# Altium schematic sheet 0001_Page 1.SchDoc
size 426 x 274 mm
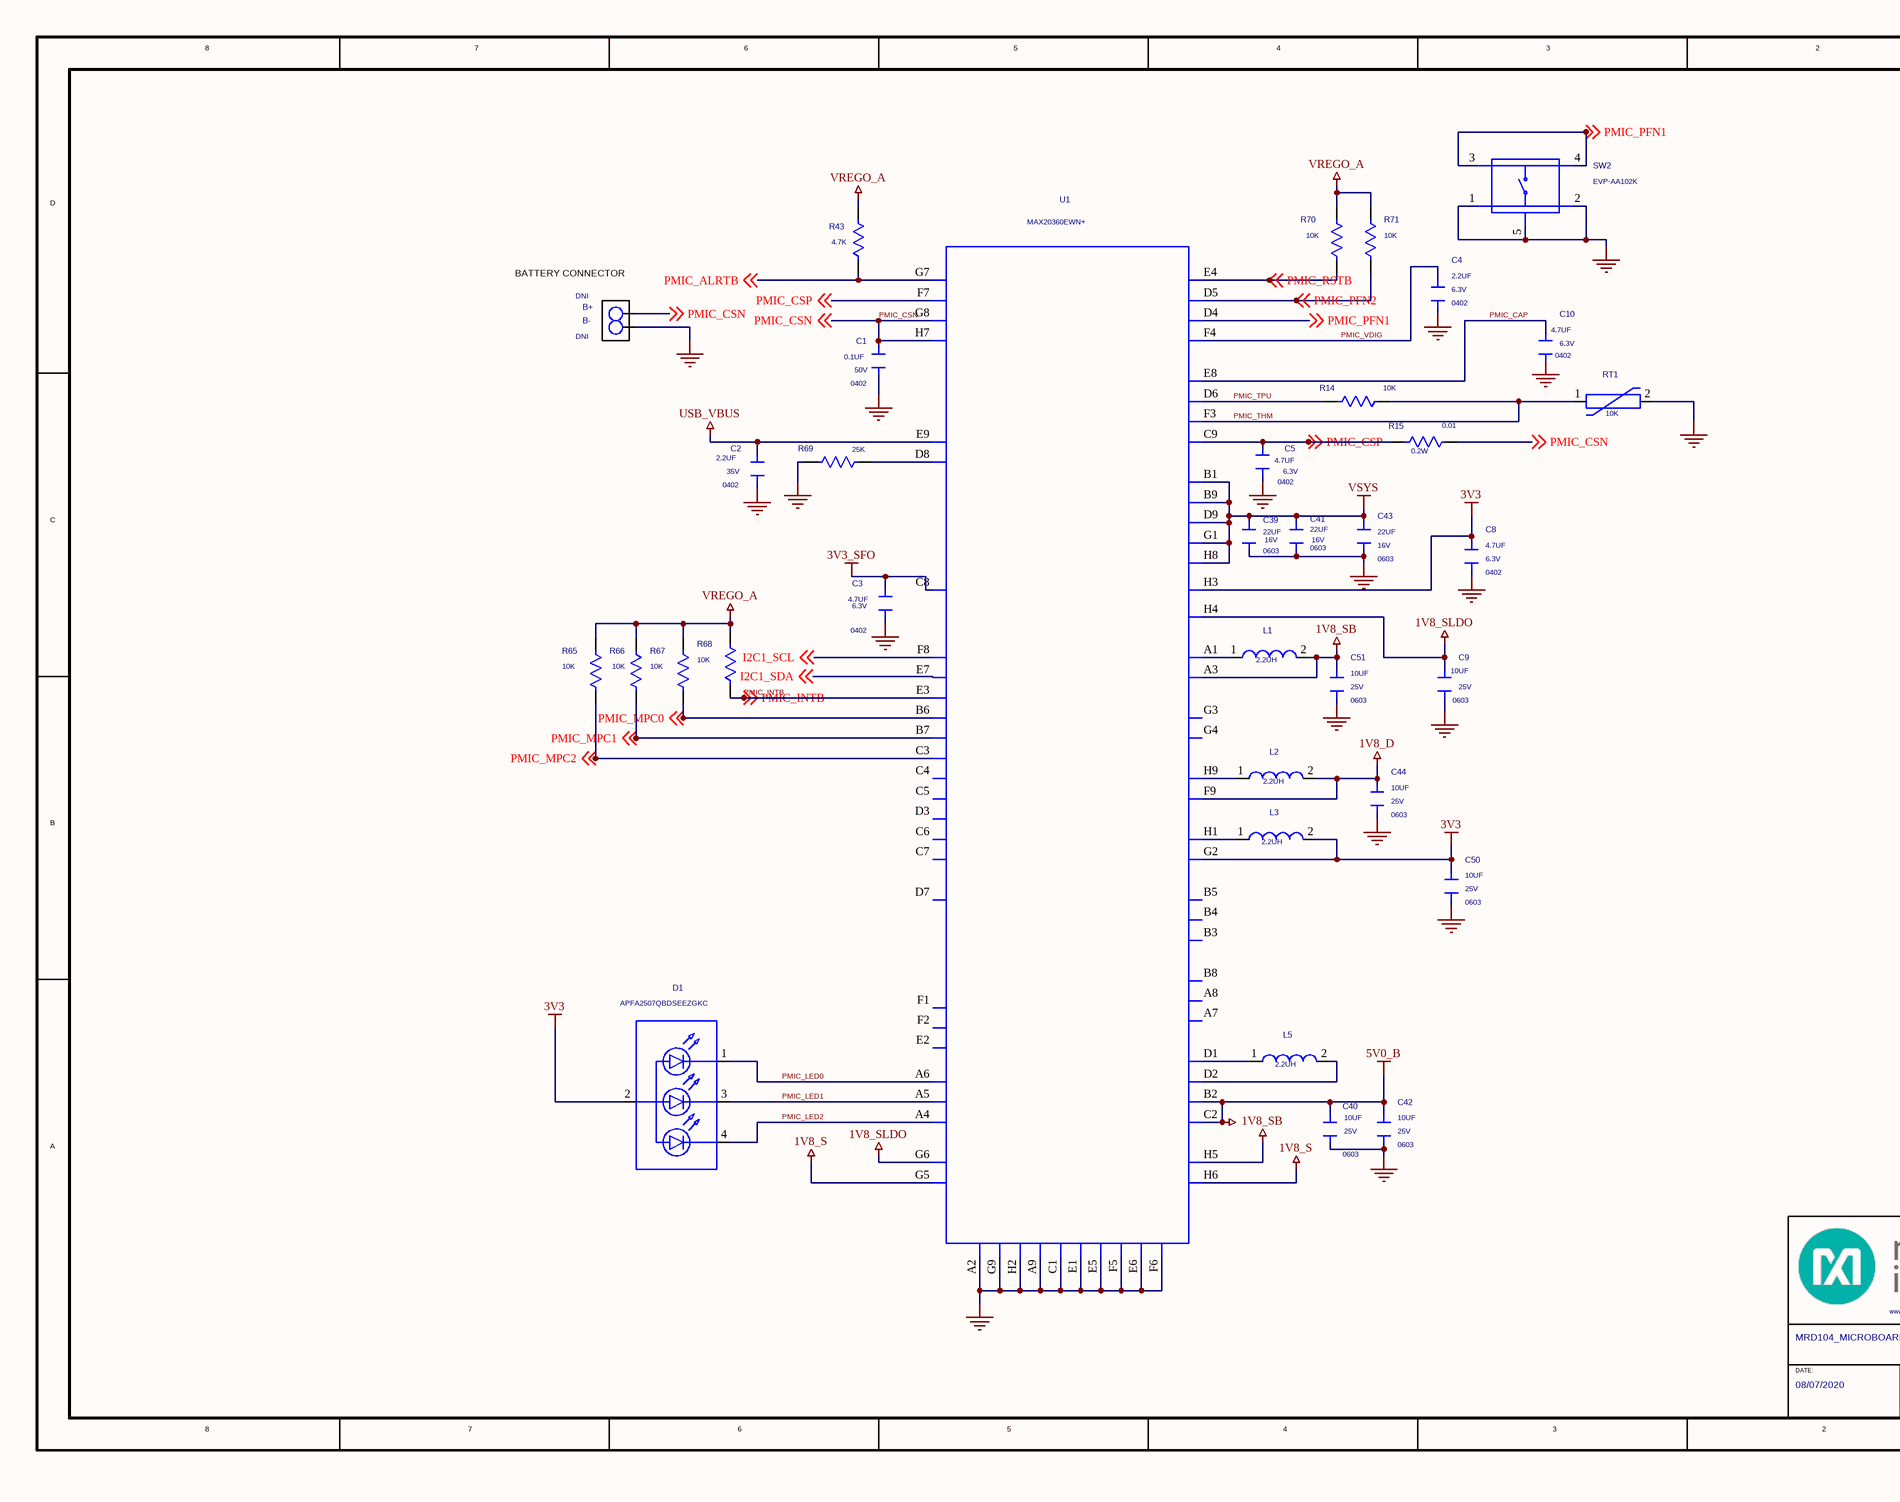
[diagram p0: 0001_Page 1.SchDoc, left]
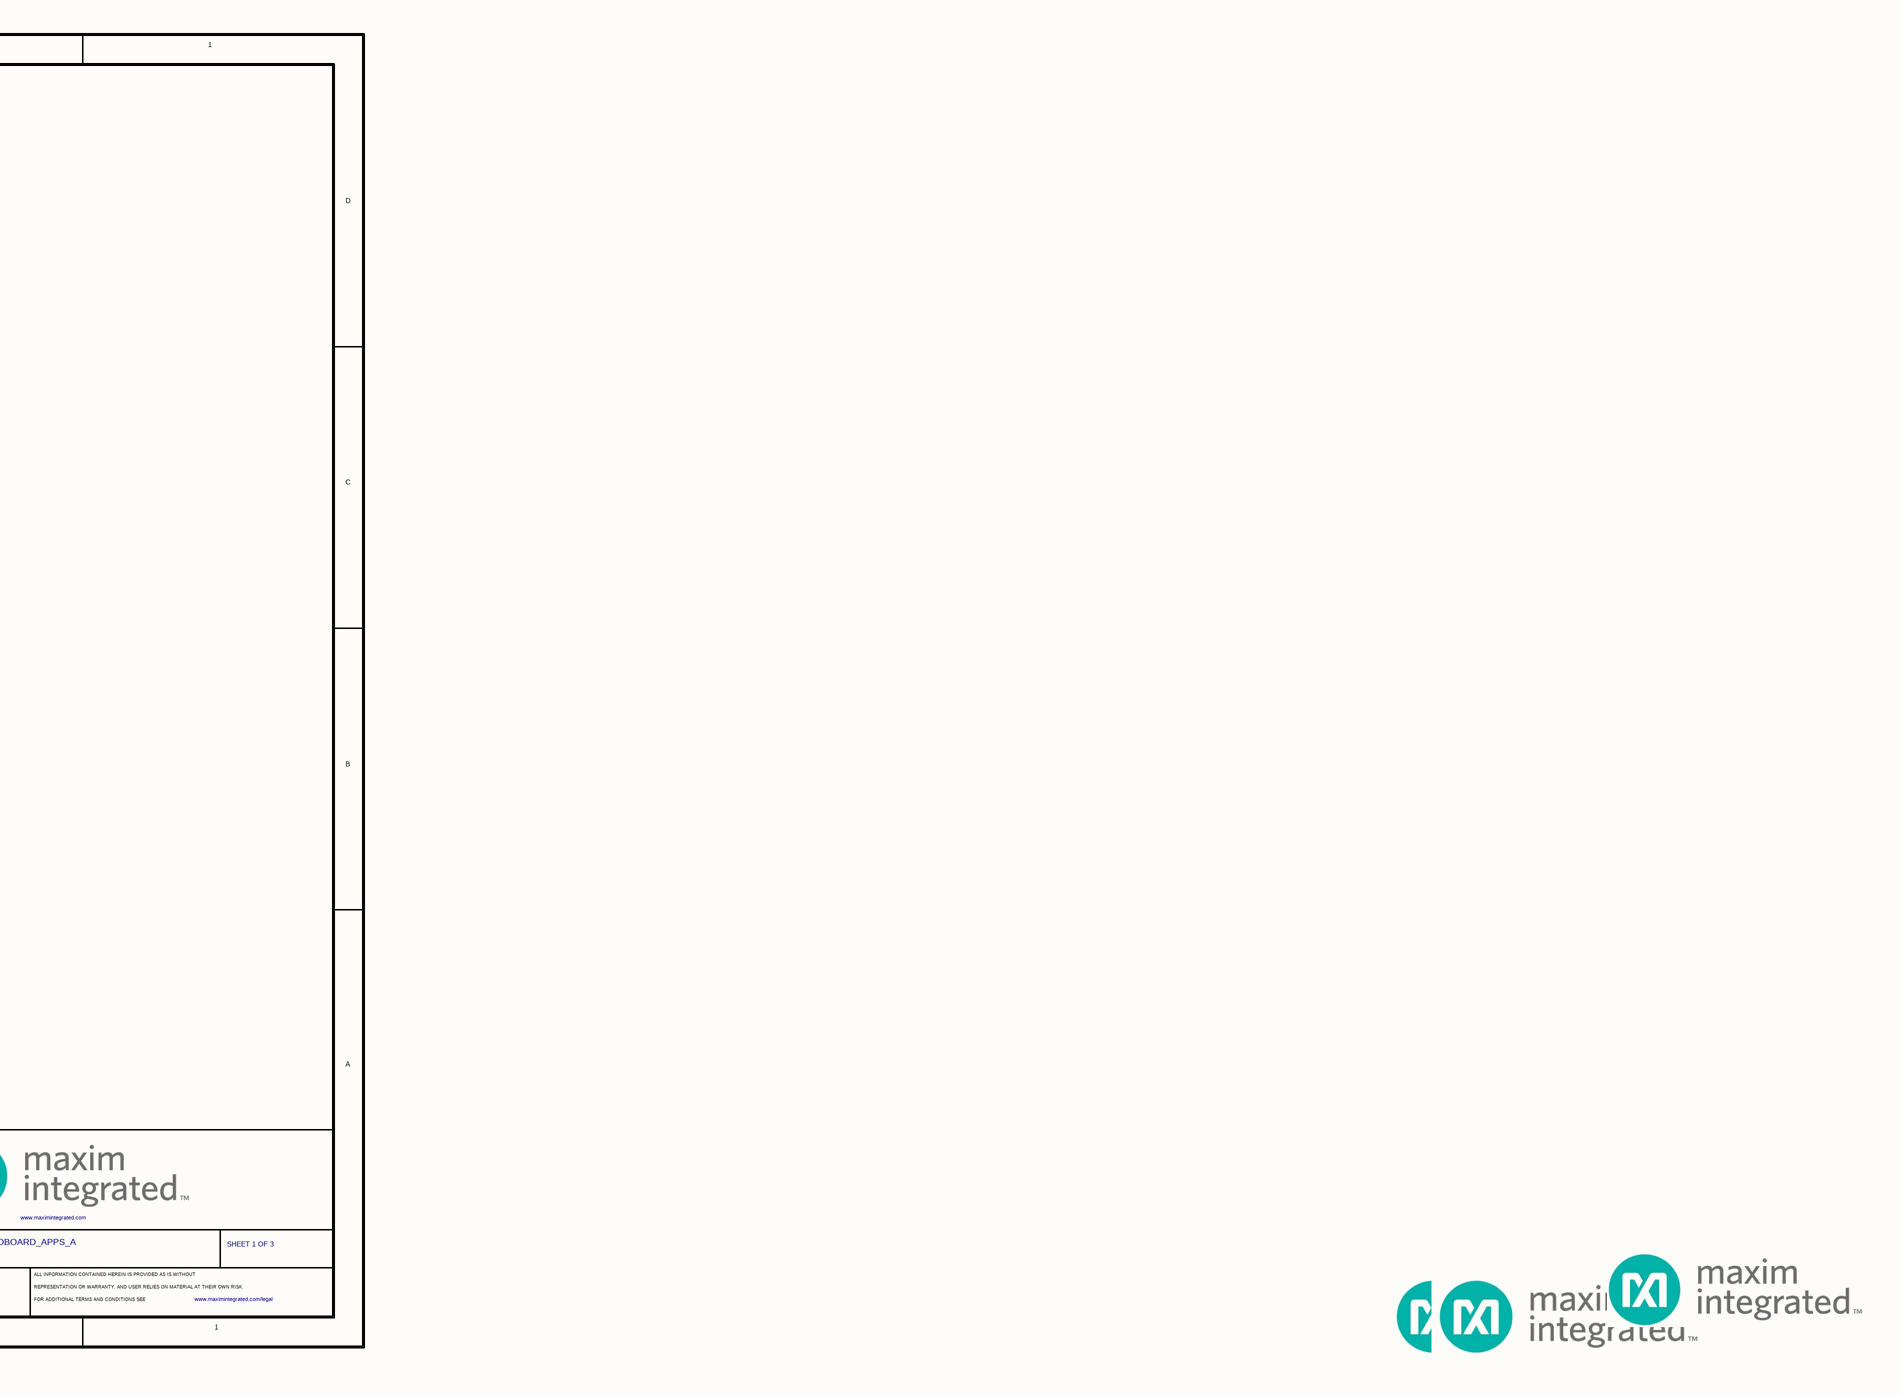
[diagram p1: 0001_Page 1.SchDoc, right]

## Parts
*  PROJECT_TITLE: MRD104_MICROBOARD_APPS_A  CUSTOM_TXT_CDS21: SHEET 1 OF 3  DATE: 08/07/2020  (hidden comment: MAXIM_B_SIZE_CF)  (graphical)
B+  VARIANT: DNI  [KEYS_5001]  (hidden comment: N/A)
B-  VARIANT: DNI  [KEYS_5001]  (hidden comment: N/A)
C1  0.1UF  VOLTAGE_RATING: 50V  [0402]
C2  2.2UF  VOLTAGE_RATING: 35V  [0402]
C3  4.7UF  VOLTAGE_RATING: 6.3V  [0402]
C4  2.2UF  VOLTAGE_RATING: 6.3V  [0402]
C5  4.7UF  VOLTAGE_RATING: 6.3V  [0402]
C8  4.7UF  VOLTAGE_RATING: 6.3V  [0402]
C9  10UF  VOLTAGE_RATING: 25V  [0603]
C10  4.7UF  VOLTAGE_RATING: 6.3V  [0402]
C39  22UF  VOLTAGE_RATING: 16V  [0603]
C40  10UF  VOLTAGE_RATING: 25V  [0603]
C41  22UF  VOLTAGE_RATING: 16V  [0603]
C42  10UF  VOLTAGE_RATING: 25V  [0603]
C43  22UF  VOLTAGE_RATING: 16V  [0603]
C44  10UF  VOLTAGE_RATING: 25V  [0603]
C50  10UF  VOLTAGE_RATING: 25V  [0603]
C51  10UF  VOLTAGE_RATING: 25V  [0603]
D1  APFA2507QBDSEEZGKC  [LED_APFA2507]
L1  2.2UH  [IND_2016]
L2  2.2UH  [IND_2016]
L3  2.2UH  [IND_2016]
L5  2.2UH  [IND_2016]
R14  10K  [0402]
R15  0.01  POWER_RATING: 0.2W  [0402]
R43  4.7K  [0402]
R65  10K  [0402]
R66  10K  [0402]
R67  10K  [0402]
R68  10K  [0402]
R69  25K  [0402]
R70  10K  [0402]
R71  10K  [0402]
RT1  10K  [THRMC0603X33M]
SW2  EVP-AA102K  [SW_EVP-AAX02X_GND]
U1  MAX20360EWN+  [MAXIM_21-100373]

## Nets
1V8_D: C44.2 L2.2 U1.F9
1V8_S: U1.G5 U1.H6
1V8_SB: C51.2 L1.2 U1.A3 U1.H5
1V8_SLDO: C9.2 U1.G6 U1.H4
3V3: C8.2 C50.2 D1.2(A) L3.2 U1.G2 U1.H3
3V3_SFO: C3.1 U1.C8
5V0_B: C40.2 C42.2 U1.B2 U1.C2
GND_POWER: B-.1(TP1) C1.1 C2.1 C3.2 C4.1 C5.1 C8.1 C9.1 C10.1 C39.1 C40.1 C41.1 C42.1 C43.1 C44.1 C50.1 C51.1 R69.1 RT1.2 SW2.1 SW2.2 SW2.5 U1.A2 U1.A9 U1.C1 U1.E1 U1.E5 U1.E6 U1.F5 U1.F6 U1.G9 U1.H2
USB_VBUS: C2.2 U1.E9
VREGO_A: R43.2 R65.2 R66.2 R67.2 R68.2 R70.2 R71.2
VSYS: C39.2 C41.2 C43.2 U1.B1 U1.B9 U1.D9 U1.G1 U1.H8
I2C1_SCL: U1.F8 ; off-sheet I2C1_SCL
I2C1_SDA: U1.E7 ; off-sheet I2C1_SDA
PMIC_ALRTB: R43.1 U1.G7 ; off-sheet PMIC_ALRTB
PMIC_CAP: C10.2 U1.E8
PMIC_CSN: B+.1(TP1) C1.2 R15.2 U1.G8 U1.H7 ; off-sheet PMIC_CSN
PMIC_CSP: C5.2 R15.1 U1.C9 U1.F7 ; off-sheet PMIC_CSP
PMIC_INTB: R68.1 U1.E3 ; off-sheet PMIC_INTB
PMIC_LED0: D1.1(K1) U1.A6
PMIC_LED1: D1.3(K2) U1.A5
PMIC_LED2: D1.4(K3) U1.A4
PMIC_MPC0: R67.1 U1.B6 ; off-sheet PMIC_MPC0
PMIC_MPC1: R66.1 U1.B7 ; off-sheet PMIC_MPC1
PMIC_MPC2: R65.1 U1.C3 ; off-sheet PMIC_MPC2
PMIC_PFN1: SW2.3 SW2.4 U1.D4 ; off-sheet PMIC_PFN1
PMIC_PFN2: R71.1 U1.D5 ; off-sheet PMIC_PFN2
PMIC_RSTB: R70.1 U1.E4 ; off-sheet PMIC_RSTB
PMIC_THM: R14.2 RT1.1 U1.F3
PMIC_TPU: R14.1 U1.D6
PMIC_VDIG: C4.2 U1.F4
NetL1_1: L1.1 U1.A1
NetL2_1: L2.1 U1.H9
NetL3_1: L3.1 U1.H1
NetL5_1: L5.1 U1.D1
NetL5_2: L5.2 U1.D2
NetR69_2: R69.2 U1.D8

Not connected (* = marked no-connect by the designer): U1 A7 A8 B3 B4 B5 B8 C4 C5 C6 C7 D3 D7 E2 F1 F2 G3 G4

## Notes on the sheet
- BATTERY CONNECTOR
- (in symbol MAXIM_B_SIZE_CF) 8; 7; 6; 5; 4; 3; 2; D; C; B; A; DATE:; ALL INFORMATION CONTAINED HEREIN IS PROVIDED AS IS WITHOUT; REPRESENTATION OR WARRANTY, AND USER RELIES ON MATERIAL AT THEIR OWN RISK.; FOR ADDITIONAL TERMS AND CONDITIONS SEE

## Library data of the parts
* = MAXIM_B_SIZE_CF: OriginalSymbolOrigin: (175,5230); COMMENT_BODY: TRUE; Page Number: 1; CURRENT_DESIGN_SHEET: Page 1; LEAGAL_WEBLINK: www.maximintegrated.com/legal; WEBLINK1: www.maximintegrated.com
B+ B- = TP: TEST POINT; PIN DIA=0.1IN; TOTAL LENGTH=0.3IN; BOARD HOLE=0.04IN; BLACK; PHOSPHOR BRONZE WIRE SILVER PLATE FINISH; RECOMMENDED FOR BOARD THICKNESS=0.062IN; NOT FOR COLD TEST; MFG_PART_NUMBER: 5001; MANUFACTURER: KEYSTONE; OriginalSymbolOrigin: (-125,50); MAXINV: 02-TPMINI5001-00; DRAWING: @MRD104_MICROBOARD_APPS_A_LIB.MRD104_MICROBOARD_APPS_A(SCH_1):PAGE5; PHYS_PAGE: 1; PACK_TYPE: TP; PCB Footprint_CDS: KEYS_5001; PART_NAME: TP; REFLOW: -; TOLERANCE: N/A; VER: 1; VOLTAGE_RATING: N/A; TEMP_RANGE: N/A
C1 = CAP_NP: CAP; SMT (0402); 0.1UF; 10%; 50V; X7R; CERAMIC; MFG_PART_NUMBER: CGA2B3X7R1H104K050BB;C1005X7R1H104K050BB;GRM155R71H104KE14;GCM155R71H104KE02;C1005X7R1H104K050BE;UMK105B7104KV-FR;CGA2B3X7R1H104K050BE; MANUFACTURER: TDK;MURATA;TDK;TAIYO YUDEN; OriginalSymbolOrigin: (-50,50); PACK_TYPE: 0402CAP; MAXINV: 20-000U1-04A; CAP: 1.00E-07; DRAWING: @MRD104_MICROBOARD_APPS_A_LIB.MRD104_MICROBOARD_APPS_A(SCH_1):PAGE5; PHYS_PAGE: 1; VER: 2; TEMP_RANGE: -55 DEGC TO +125 DEGC; MATERIAL_TYPE: CERAMIC CHIP; VLOG_PARAM01: CAP:INTEGER; PCB Footprint_CDS: 0402; CASE: SMT (0402); REFLOW: -; TOLERANCE: 10%
C2 = CAP_NP: CAP; SMT (0402); 2.2UF; 10%; 35V; X5R; CERAMIC; MFG_PART_NUMBER: C1005X5R1V225K050BC; MANUFACTURER: TDK; OriginalSymbolOrigin: (-50,50); PACK_TYPE: 0402CAP; MAXINV: EC111000002275; CAP: 2.20E-06; DRAWING: @MRD104_MICROBOARD_APPS_A_LIB.MRD104_MICROBOARD_APPS_A(SCH_1):PAGE5; PHYS_PAGE: 1; VER: 2; TEMP_RANGE: -55 DEGC TO +85 DEGC; MATERIAL_TYPE: CERAMIC CHIP; VLOG_PARAM01: CAP:INTEGER; PCB Footprint_CDS: 0402; CASE: SMT (0402); REFLOW: -; TOLERANCE: 10%
C3 = CAP_NP#1: CAP; SMT (0402); 4.7UF; 10%; 6.3V; X5R; CERAMIC; MFG_PART_NUMBER: C1005X5R0J475K050BC; MANUFACTURER: TDK; OriginalSymbolOrigin: (-50,50); PACK_TYPE: 0402CAP; MAXINV: 20-004U7-19; CAP: 4.70E-06; DRAWING: @MRD104_MICROBOARD_APPS_A_LIB.MRD104_MICROBOARD_APPS_A(SCH_1):PAGE5; PHYS_PAGE: 1; TEMP_RANGE: -55 DEGC TO +85 DEGC; VLOG_PARAM01: CAP:INTEGER; MATERIAL_TYPE: CERAMIC CHIP; PCB Footprint_CDS: 0402; CASE: SMT (0402); REFLOW: -; TOLERANCE: 10%; VER: 1
C4 = CAP_NP: CAP; SMT (0402); 2.2UF; 10%; 6.3V; X5R; CERAMIC; MFG_PART_NUMBER: C1005X5R0J225K050BC;CL05A225KQ5NSN; MANUFACTURER: TDK;SAMSUNG; OriginalSymbolOrigin: (-50,50); PACK_TYPE: 0402CAP; MAXINV: 20-002U2-19; CAP: 2.20E-06; DRAWING: @MRD104_MICROBOARD_APPS_A_LIB.MRD104_MICROBOARD_APPS_A(SCH_1):PAGE5; PHYS_PAGE: 1; VER: 2; TEMP_RANGE: -55 DEGC TO +85 DEGC; VLOG_PARAM01: CAP:INTEGER; MATERIAL_TYPE: CERAMIC CHIP; PCB Footprint_CDS: 0402; CASE: SMT (0402); REFLOW: -; TOLERANCE: 10%
C5 C10 = CAP_NP: CAP; SMT (0402); 4.7UF; 10%; 6.3V; X5R; CERAMIC; MFG_PART_NUMBER: C1005X5R0J475K050BC; MANUFACTURER: TDK; OriginalSymbolOrigin: (-50,50); PACK_TYPE: 0402CAP; MAXINV: 20-004U7-19; CAP: 4.70E-06; DRAWING: @MRD104_MICROBOARD_APPS_A_LIB.MRD104_MICROBOARD_APPS_A(SCH_1):PAGE5; PHYS_PAGE: 1; VER: 2; TEMP_RANGE: -55 DEGC TO +85 DEGC; MATERIAL_TYPE: CERAMIC CHIP; VLOG_PARAM01: CAP:INTEGER; PCB Footprint_CDS: 0402; CASE: SMT (0402); REFLOW: -; TOLERANCE: 10%
C8 = CAP_NP: CAP; SMT (0402); 4.7UF; 10%; 6.3V; X5R; CERAMIC; MFG_PART_NUMBER: C1005X5R0J475K050BC; MANUFACTURER: TDK; OriginalSymbolOrigin: (-50,50); PACK_TYPE: 0402CAP; MAXINV: 20-004U7-19; CAP: 4.70E-06; DRAWING: @MRD104_MICROBOARD_APPS_A_LIB.MRD104_MICROBOARD_APPS_A(SCH_1):PAGE5; PHYS_PAGE: 1; VER: 2; TEMP_RANGE: -55 DEGC TO +85 DEGC; VLOG_PARAM01: CAP:INTEGER; MATERIAL_TYPE: CERAMIC CHIP; PCB Footprint_CDS: 0402; CASE: SMT (0402); REFLOW: -; TOLERANCE: 10%
C9 C42 C51 = CAP_NP: CAP; SMT (0603); 10UF; 20%; 25V; X5R; CERAMIC; MFG_PART_NUMBER: C1608X5R1E106M080AC;CL10A106MA8NRNC;GRM188R61E106MA73;ZRB18AR61E106ME01;GRT188R61E106ME13; MANUFACTURER: TDK;SAMSUNG ELECTRONICS;MURATA;MURATA;MURATA; OriginalSymbolOrigin: (-50,50); PACK_TYPE: 0603CAP; MAXINV: 20-0010U-P7; CAP: 1.00E-05; COMMENTS: USE ONLY GRM188R61E106MA73; DRAWING: @MRD104_MICROBOARD_APPS_A_LIB.MRD104_MICROBOARD_APPS_A(SCH_1):PAGE5; PHYS_PAGE: 1; VER: 2; TEMP_RANGE: -55 DEGC TO +85 DEGC; VLOG_PARAM01: CAP:INTEGER; MATERIAL_TYPE: CERAMIC CHIP; PCB Footprint_CDS: 0603; CASE: SMT (0603); REFLOW: -; TOLERANCE: 20%
C39 C41 C43 = CAP_NP: CAP; SMT (0603); 22UF; 20%; 16V; X5R; CERAMIC; MFG_PART_NUMBER: CL10A226MO7JZNC; MANUFACTURER: SAMSUNG ELECTRONICS; OriginalSymbolOrigin: (-50,50); PACK_TYPE: 0603CAP; MAXINV: 20-0022U-A29; CAP: 2.20E-05; DRAWING: @MRD104_MICROBOARD_APPS_A_LIB.MRD104_MICROBOARD_APPS_A(SCH_1):PAGE5; PHYS_PAGE: 1; VER: 2; TEMP_RANGE: -55 DEGC TO +85 DEGC; VLOG_PARAM01: CAP:INTEGER; PCB Footprint_CDS: 0603; CASE: SMT (0603); TOLERANCE: 20%
C40 C44 C50 = CAP_NP: CAP; SMT (0603); 10UF; 20%; 25V; X5R; CERAMIC; MFG_PART_NUMBER: C1608X5R1E106M080AC;CL10A106MA8NRNC;GRM188R61E106MA73;ZRB18AR61E106ME01;GRT188R61E106ME13; MANUFACTURER: TDK;SAMSUNG ELECTRONICS;MURATA;MURATA;MURATA; OriginalSymbolOrigin: (-50,50); PACK_TYPE: 0603CAP; MAXINV: 20-0010U-P7; CAP: 1.00E-05; COMMENTS: USE ONLY GRM188R61E106MA73; DRAWING: @MRD104_MICROBOARD_APPS_A_LIB.MRD104_MICROBOARD_APPS_A(SCH_1):PAGE5; PHYS_PAGE: 1; VER: 2; TEMP_RANGE: -55 DEGC TO +85 DEGC; MATERIAL_TYPE: CERAMIC CHIP; VLOG_PARAM01: CAP:INTEGER; PCB Footprint_CDS: 0603; CASE: SMT (0603); REFLOW: -; TOLERANCE: 20%
D1 = LED_4P: DIODE; LED; BLUE-RED-GREEN; SMT; VF=BLUE:+3.3V;RED:+2V;GRN:+3.3V; IF=BLUE:0.02A;RED:0.02A;GRN:0.02A; MANUFACTURER: KINGBRIGHT; OriginalSymbolOrigin: (-150,275); PACK_TYPE: SMT250X100X70_4P; MAXINV: ED1230; DRAWING: @MRD104_MICROBOARD_APPS_A_LIB.MRD104_MICROBOARD_APPS_A(SCH_1):PAGE5; PHYS_PAGE: 1; VER: 6; TEMP_RANGE: -40 DEGC TO +85 DEGC; PCB Footprint_CDS: LED_APFA2507; MFG_PART_NUMBER: APFA2507QBDSEEZGKC; TOLERANCE: N/A; VOLTAGE_RATING: BLUE:+3.3V;RED:+2V;GRN:+3.3V
L1-L3 L5 = INDUCT: INDUCTOR; SMT (0806); WIREWOUND CHIP; 2.2UH; TOL=+/-20%; 1.8A; MFG_PART_NUMBER: DFE201612E-2R2M; MANUFACTURER: MURATA; OriginalSymbolOrigin: (-100,50); PACK_TYPE: 0806; MAXINV: 50-002U2-0PD; DRAWING: @MRD104_MICROBOARD_APPS_A_LIB.MRD104_MICROBOARD_APPS_A(SCH_1):PAGE5; PHYS_PAGE: 1; TOLERANCE: 20%; TEMP_RANGE: -40 DEGC TO +125 DEGC; PCB Footprint_CDS: IND_2016; CASE: SMT (0806); VER: 1; MATERIAL_TYPE: WIREWOUND
R14 = RES_SMD#1: RES; SMT (0402); 10K; 5%; +/-200PPM/DEGC; 0.1000W; MFG_PART_NUMBER: ERJ-2GEJ103; MANUFACTURER: PANASONIC; OriginalSymbolOrigin: (-50,75); PACK_TYPE: 0402RES; MAXINV: 80-0010K-Q6; DRAWING: @MRD104_MICROBOARD_APPS_A_LIB.MRD104_MICROBOARD_APPS_A(SCH_1):PAGE5; PHYS_PAGE: 1; POWER_RATING: 0.10W; RES: 1.00E04; VER: 4; TEMP_RANGE: -55 DEGC TO +155 DEGC; MATERIAL_TYPE: THICK FILM; VLOG_PARAM01: RES:INTEGER; PCB Footprint_CDS: 0402; CASE: SMT (0402); REFLOW: -; TOLERANCE: 5%
R15 = RES_SMD#1: RES; SMT (0402); 0.01; 1%; 0 TO +500PPM/DEGC; 0.2000W; MFG_PART_NUMBER: ERJ-2LWFR010; MANUFACTURER: PANASONIC; OriginalSymbolOrigin: (-50,75); PACK_TYPE: 0402RES; MAXINV: ER111000002587; DRAWING: @MRD104_MICROBOARD_APPS_A_LIB.MRD104_MICROBOARD_APPS_A(SCH_1):PAGE5; PHYS_PAGE: 1; RES: 1.00E-02; VER: 4; TEMP_RANGE: -55 DEGC TO +125 DEGC; VLOG_PARAM01: RES:INTEGER; MATERIAL_TYPE: THICK FILM; PCB Footprint_CDS: 0402; CASE: SMT (0402); REFLOW: -; TOLERANCE: 1%
R43 = RES_SMD: RES; SMT (0402); 4.7K; 1%; +/-100PPM/DEGC; 0.0630W; MFG_PART_NUMBER: CRCW04024K70FK;MCR01MZPF4701; MANUFACTURER: VISHAY DALE;ROHM SEMICONDUCTOR; OriginalSymbolOrigin: (-75,50); PACK_TYPE: 0402RES; MAXINV: 80-004K7-23; DRAWING: @MRD104_MICROBOARD_APPS_A_LIB.MRD104_MICROBOARD_APPS_A(SCH_1):PAGE5; PHYS_PAGE: 1; RES: 4.70E03; VER: 2; TEMP_RANGE: -55 DEGC TO +155 DEGC; MATERIAL_TYPE: THICK FILM; VLOG_PARAM01: RES:INTEGER; PCB Footprint_CDS: 0402; CASE: SMT (0402); POWER_RATING: N/A; REFLOW: -; TOLERANCE: 1%
R65 R67 = RES_SMD: RES; SMT (0402); 10K; 1%; +/-100PPM/DEGC; 0.0630W; MFG_PART_NUMBER: CRCW040210K0FK;RC0402FR-0710KL; MANUFACTURER: VISHAY DALE;YAGEO PHICOMP; OriginalSymbolOrigin: (-75,50); PACK_TYPE: 0402RES; MAXINV: 80-0010K-23; DRAWING: @MRD104_MICROBOARD_APPS_A_LIB.MRD104_MICROBOARD_APPS_A(SCH_1):PAGE5; PHYS_PAGE: 1; POWER_RATING: 0.0625W; RES: 1.00E04; VER: 2; TEMP_RANGE: -55 DEGC TO +155 DEGC; MATERIAL_TYPE: THICK FILM; VLOG_PARAM01: RES:INTEGER; PCB Footprint_CDS: 0402; CASE: SMT (0402); TOLERANCE: 1%
R66 R68 = RES_SMD: RES; SMT (0402); 10K; 1%; +/-100PPM/DEGC; 0.0630W; MFG_PART_NUMBER: CRCW040210K0FK;RC0402FR-0710KL; MANUFACTURER: VISHAY DALE;YAGEO PHICOMP; OriginalSymbolOrigin: (-75,50); PACK_TYPE: 0402RES; MAXINV: 80-0010K-23; DRAWING: @MRD104_MICROBOARD_APPS_A_LIB.MRD104_MICROBOARD_APPS_A(SCH_1):PAGE5; PHYS_PAGE: 1; POWER_RATING: 0.0625W; RES: 1.00E04; VER: 2; TEMP_RANGE: -55 DEGC TO +155 DEGC; VLOG_PARAM01: RES:INTEGER; MATERIAL_TYPE: THICK FILM; PCB Footprint_CDS: 0402; CASE: SMT (0402); TOLERANCE: 1%
R69 = RES_SMD: RES; SMT (0402); 25K; 0.10%; +/-25PPM/DEGK; 0.0500W; MFG_PART_NUMBER: PNM0402E2502BS; MANUFACTURER: VISHAY DALE; OriginalSymbolOrigin: (-75,50); PACK_TYPE: 0402RES; MAXINV: 80-0025K-BA64; DRAWING: @MRD104_MICROBOARD_APPS_A_LIB.MRD104_MICROBOARD_APPS_A(SCH_1):PAGE5; PHYS_PAGE: 1; POWER_RATING: 0.05W; RES: 2.50E04; TOLERANCE: 0.1%; VER: 2; TEMP_RANGE: -55 DEGC TO +155 DEGC; MATERIAL_TYPE: THIN FILM; VLOG_PARAM01: RES:INTEGER; PCB Footprint_CDS: 0402; CASE: SMT (0402)
R70 R71 = RES_SMD: RES; SMT (0402); 10K; 1%; +/-100PPM/DEGC; 0.0630W; MFG_PART_NUMBER: CRCW040210K0FK;RC0402FR-0710KL; MANUFACTURER: VISHAY DALE;YAGEO PHICOMP; OriginalSymbolOrigin: (-75,50); PACK_TYPE: 0402RES; MAXINV: 80-0010K-23; DRAWING: @MRD104_MICROBOARD_APPS_A_LIB.MRD104_MICROBOARD_APPS_A(SCH_1):PAGE5; PHYS_PAGE: 1; POWER_RATING: 0.0625W; RES: 1.00E04; VER: 2; TEMP_RANGE: -55 DEGC TO +155 DEGC; VLOG_PARAM01: RES:INTEGER; PCB Footprint_CDS: 0402; CASE: SMT (0402); TOLERANCE: 1%
RT1 = THERMISTOR_SMD: THERMISTOR; SMT (0201); 10K OHM; TOL=+/-5%; MFG_PART_NUMBER: NCP03XH103J05; MANUFACTURER: MURATA; OriginalSymbolOrigin: (-100,50); PACK_TYPE: 0201M; MAXINV: 83-0010K-0AN; DRAWING: @MRD104_MICROBOARD_APPS_A_LIB.MRD104_MICROBOARD_APPS_A(SCH_1):PAGE5; PHYS_PAGE: 1; TOLERANCE: 5%; TEMP_RANGE: -40 DEGC TO +125 DEGC; PCB Footprint_CDS: THRMC0603X33M; VER: 1
SW2 = EVP-AAXXXX: SWITCH; SPST; SMT; 15V; 0.02A; EVPAA SERIES WITH GROUND TERMINAL; LIGHT TOUCH SWITCH; RCONTACT=0.1 OHM; RINSULATION=100M OHM; WITH SPECIAL ASSEMBLY INSTRUCTIONS; MANUFACTURER: PANASONIC; OriginalSymbolOrigin: (-175,125); PACK_TYPE: SMT_GND; MAXINV: EH111000005105; DRAWING: @MRD104_MICROBOARD_APPS_A_LIB.MRD104_MICROBOARD_APPS_A(SCH_1):PAGE5; PHYS_PAGE: 1; VER: 3; VOLTAGE_RATING: +2V TO +15V; TEMP_RANGE: -40 DEGC TO +85 DEGC; PCB Footprint_CDS: SW_EVP-AAX02X_GND; MFG_PART_NUMBER: EVP-AA102K; TOLERANCE: N/A
U1 = EK_MAX20360: EVKIT PART- IC; WEARABLE POWER NAMAGEMENT SOLUTION; PACKAGE OUTLINE DRAWING: 21-100373; WLP 72 PINS; 0.5MM PITCH; PKG. CODE: W724A4+1; MANUFACTURER: MAXIM; OriginalSymbolOrigin: (-500,1875); PACK_TYPE: WLP72; COMMENTS: THIS PART NUMBER WILL BE CUSTOMIZED FOR HSP/MRD104 AND UPDATED, CONFIRM THE PART NUMBER BEFORE ORDER; DRAWING: @MRD104_MICROBOARD_APPS_A_LIB.MRD104_MICROBOARD_APPS_A(SCH_1):PAGE5; PHYS_PAGE: 1; TEMP_RANGE: -40 DEGC TO +85 DEGC; MAXINV: N/A; PCB Footprint_CDS: MAXIM_21-100373; MFG_PART_NUMBER: MAX20360EWN+; SEC_TYPE: WLP72; TOLERANCE: N/A; VER: 1; VOLTAGE_RATING: N/A